# EAGLE design Flutter-v1 (EAGLE 9.6.1)
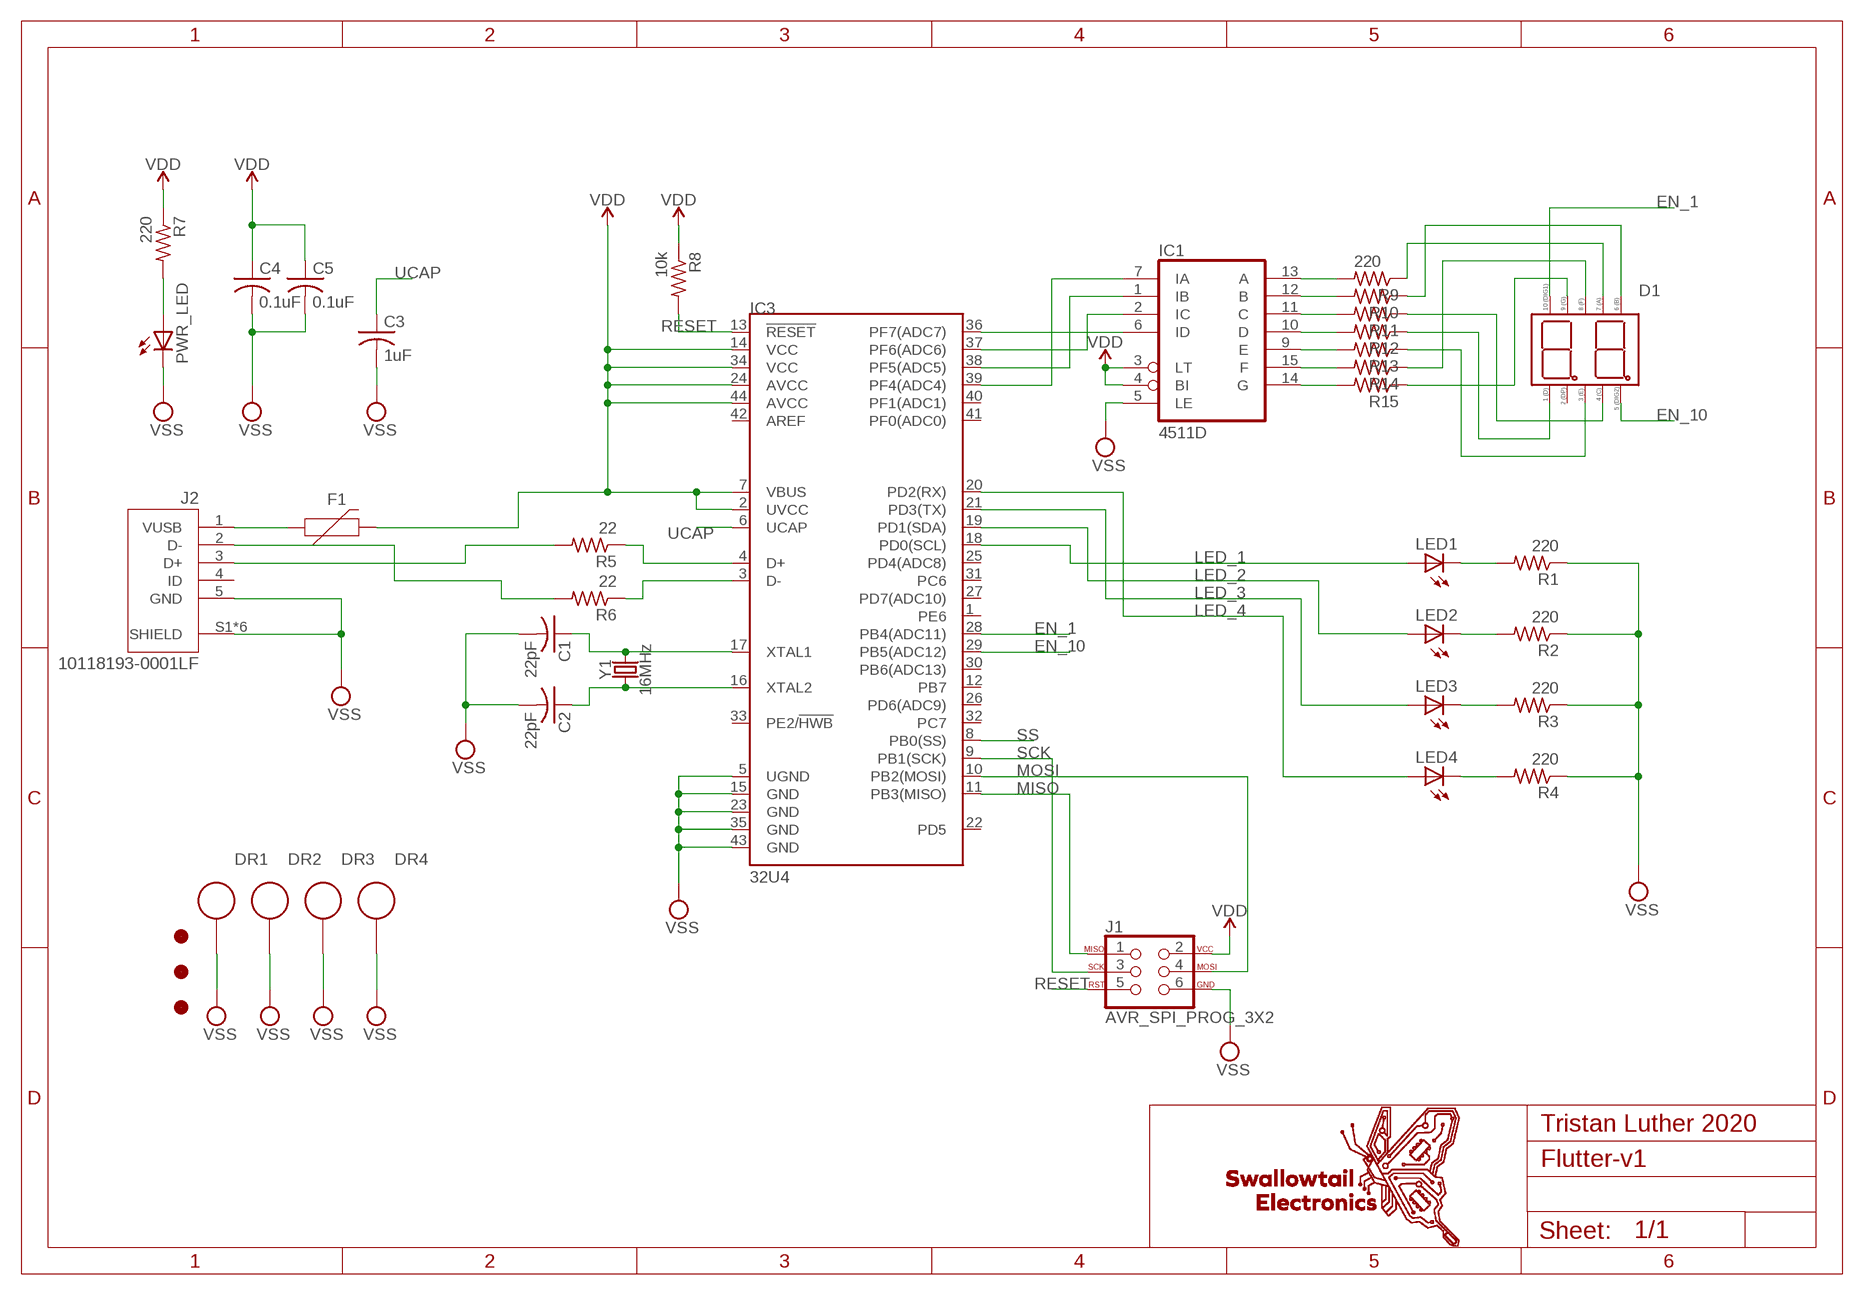
[diagram p0: schematic, sheet 1]

## Parts
C1  22pF  C-USC0805  [C0805]
C2  22pF  C-USC0805  [C0805]
C3  1uF  C-USC0805  [C0805]
C4  0.1uF  C-USC0805  [C0805]
C5  0.1uF  C-USC0805  [C0805]
D1  4201AS  [4201AS]
DR1  3MM_DRILL_GND  [3MM_DRILL_GND]
DR2  3MM_DRILL_GND  [3MM_DRILL_GND]
DR3  3MM_DRILL_GND  [3MM_DRILL_GND]
DR4  3MM_DRILL_GND  [3MM_DRILL_GND]
F1  6V/0.5A  PPTC_HALF-AMP  [1206]
IC1  4511D  [SO16]
IC3  32U4  ATMEGA32U4TQFP-44  [TQFP44]
J1  AVR_SPI_PROG_3X2  [2X3-NS]
J2  10118193-0001LF  [FCI_10118193-0001LF]
LED1  LED5MM  [LED5MM]
LED2  LED5MM  [LED5MM]
LED3  LED5MM  [LED5MM]
LED4  LED5MM  [LED5MM]
PWR_LED  LEDCHIPLED_0603  [CHIPLED_0603]
R1  220  R-US_M0805  [M0805]
R2  220  R-US_M0805  [M0805]
R3  220  R-US_M0805  [M0805]
R4  220  R-US_M0805  [M0805]
R5  22  R-US_M0805  [M0805]
R6  22  R-US_M0805  [M0805]
R7  220  R-US_M0805  [M0805]
R8  10k  R-US_M0805  [M0805]
R9  220  R-US_M0805  [M0805]
R10  220  R-US_M0805  [M0805]
R11  220  R-US_M0805  [M0805]
R12  220  R-US_M0805  [M0805]
R13  220  R-US_M0805  [M0805]
R14  220  R-US_M0805  [M0805]
R15  220  R-US_M0805  [M0805]
U$4  FIDUCIAL_MARKER  [FIDUCIAL_MARKER]
U$5  FIDUCIAL_MARKER  [FIDUCIAL_MARKER]
U$6  FIDUCIAL_MARKER  [FIDUCIAL_MARKER]
Y1  16MHz  CRYSTAL-16MHZSMD-5X3.2  [CRYSTAL-SMD-5X3.2-4PAD]

## Nets
EN_1: D1.10 IC3.28(PB4(ADC11))
EN_10: D1.5(5(DIG_2)) IC3.29(PB5(ADC12))
LED_1: IC3.18(PD0(SCL)) LED1.A
LED_2: IC3.19(PD1(SDA)) LED2.A
LED_3: IC3.21(PD3(TX)) LED3.A
LED_4: IC3.20(PD2(RX)) LED4.A
MISO: IC3.11(PB3(MISO)) J1.1
MOSI: IC3.10(PB2(MOSI)) J1.4
N$1: IC3.4(D+) R5.1
N$2: IC3.3(D-) R6.1
N$3: J2.3(D+) R5.2
N$4: J2.2(D-) R6.2
N$5 [VDD/VSS]: PWR_LED.A R7.2
N$6: C1.1 IC3.17(XTAL1) Y1.3
N$7: C2.1 IC3.16(XTAL2) Y1.1
N$8: IC1.13(A) R9.2
N$9: LED1.K(C) R1.2
N$10: LED2.K(C) R2.2
N$11: LED3.K(C) R3.2
N$12: LED4.K(C) R4.2
N$13: IC1.12(B) R10.2
N$14: IC1.11(C) R11.2
N$15: IC1.10(D) R12.2
N$16: IC1.9(E) R13.2
N$17: IC1.15(F) R14.2
N$18: IC1.14(G) R15.2
N$19 [VDD/VSS]: F1.1 J2.1(VUSB)
N$20: D1.7(7(A)) R9.1
N$21: D1.6(6(B)) R10.1
N$22: D1.4(4(C)) R11.1
N$23: IC1.7(IA) IC3.39(PF4(ADC4))
N$24: IC1.1(IB) IC3.38(PF5(ADC5))
N$25: IC1.2(IC) IC3.37(PF6(ADC6))
N$26: IC1.6(ID) IC3.36(PF7(ADC7))
N$27: D1.1(1(D)) R12.1
N$28: D1.3(3(E)) R13.1
N$29: D1.8(8(F)) R14.1
N$30: D1.9(9(G)) R15.1
RESET: IC3.13(!RESET) J1.5 R8.2
SCK: IC3.9(PB1(SCK)) J1.3
SS: IC3.8(PB0(SS))
UCAP: C3.1 IC3.6(UCAP)
VDD: C4.1 C5.1 F1.2 IC1.3(LT) IC1.4(BI) IC3.2(UVCC) IC3.7(VBUS) IC3.14(VCC) IC3.24(AVCC) IC3.34(VCC) IC3.44(AVCC) J1.2 R7.1 R8.1
VSS [VDD/VSS]: C1.2 C2.2 C3.2 C4.2 C5.2 DR1.DR(D$1) DR2.DR(D$1) DR3.DR(D$1) DR4.DR(D$1) IC1.5(LE) IC3.5(UGND) IC3.15(GND) IC3.23(GND) IC3.35(GND) IC3.43(GND) J1.6 J2.5(GND) J2.S1(SHIELD) J2.S2(SHIELD) J2.S3(SHIELD) J2.S4(SHIELD) J2.S5(SHIELD) J2.S6(SHIELD) PWR_LED.C R1.1 R2.1 R3.1 R4.1
Unconnected: D1.2(2(DP)) IC3.1(PE6) IC3.12(PB7) IC3.22(PD5) IC3.25(PD4(ADC8)) IC3.26(PD6(ADC9)) IC3.27(PD7(ADC10)) IC3.30(PB6(ADC13)) IC3.31(PC6) IC3.32(PC7) IC3.33(PE2/!HWB) IC3.40(PF1(ADC1)) IC3.41(PF0(ADC0)) IC3.42(AREF) J2.4(ID)

## Power pins joined to a net without a drawn wire
VDD: IC1.16(VDD)
VSS: IC1.8(VSS)

## Library data of the parts
C1-C5 = adafruit:C-US: CAPACITOR, American symbol
D1 = MyLibrary:4201AS: 4201AS Dual Common Cathode Seven Segment Display Common China Export: Sale Link <https://www.aliexpress.com/item/32910087970.html?spm=a2g0o.productlist.0.0.5d2916435btpmH&algo_pvid=f7d3615c-b2d9-4175-8957-436fe814a7c2&algo_expid=f7d3615c-b2d9-4175-8957-436fe814a7c2-1&btsid=0ab50a5715883508853971879e6b41&ws_ab_test=searchweb0_0,searchweb201602_,searchweb201603_>
DR1-DR4 = MyLibrary:3MM_DRILL_GND: Common 3mm Machine Screw Hole. Better than your standard drill! Connects to the ground of the circuit board to the enclosure.
F1 = SparkFun-Fuses:PPTC: Resettable Fuse PPTC Resettable Fuse. Really a sort of resistor with a polymeric positive temperature coefficient whose resistance increases dramatically with an increase in temperature. When heated by the power passing through the resistance rises causing the current to be limited, protecting the circuit. This is achieved by the transition of the polymer from a crystalline to an amorphous state where the conductive carbon separates breaking the conductive pathways found in the cool crystalline structure. When a PPTC cools back down it resumes conducting letting the circuit turn back on. SparkFun Products: SparkFun RedBoard - Programmed with Arduino <https://www.sparkfun.com/products/12757> Pro Micro - 5V/16MHz <https://www.sparkfun.com/products/12640> Arduino Pro 328 - 5V/16MHz <https://www.sparkfun.com/products/10915> MP3 Trigger <https://www.sparkfun.com/products/13720>; PROD_ID: RES-08585
IC1 = 45xx:4511: BCD to 7-segment LATCH/DECODER/DRIVER
IC3 = SparkFun-IC-Microcontroller:ATMEGA32U4: Atmel MCU, 32KByte Atmel 44-pin 8-bit Microcontroller with 32KBytes of ISP Flash and USB Controller Datasheet <http://cdn.sparkfun.com/datasheets/Dev/Arduino/Boards/ATMega32U4.pdf> SparkFun Products LilyPad Arduino USB - ATmega32U4 Board <https://www.sparkfun.com/products/12049> (DEV-12049) Pro Micro - 5V/16MHz <https://www.sparkfun.com/products/12640> (DEV-12640) Pro Micro - 3.3V/8MHz <https://www.sparkfun.com/products/12587> (DEV-12587) Fio v3 - ATmega32U4 <https://www.sparkfun.com/products/11520> (DEV-11520) Qduino Mini <https://www.sparkfun.com/products/13614> (DEV-13614) Makey Makey - Standard Kit <https://www.sparkfun.com/products/11511> (WIG-11511) Makey Makey Deluxe Kit <https://www.sparkfun.com/products/11519> (WIG-11519); PROD_ID: IC-11161
J1 = MyLibrary:AVR_SPI_PROG_3X2: AVR ISP 6 Pin This is the reduced ISP connector for AVR programming. Common on Arduino. This footprint will take up less PCB space and can be used with a 10-pin to 6-pin adapter such as SKU: BOB-08508 **Special note about "TEST_POINT" package. The stop mask is on the top side, so if you want your programming test points to be on the bottom of your board, make sure to place this package on the bottom side of the board. This also ensure that the orientation to program from the bottom side will be correct. SparkFun Products: SparkFun ISP Pogo Adapter <https://www.sparkfun.com/products/11591> - NS Tiny AVR Programmer <https://www.sparkfun.com/products/11801> -PTH
J2 = MyLibrary:10118193-0001LF: Micro USB B Type Receptacle; AVAILABILITY: Unavailable; DESCRIPTION: USB - micro B USB 2.0 Receptacle Connector 5 Position Surface Mount, Right Angle; Through Hole; MF: Amphenol ICC; MP: 10118193-0001LF; PACKAGE: None; PRICE: None
LED1-LED4 = MyLibrary:LED: LED OSRAM: - CHIPLED LG R971, LG N971, LY N971, LG Q971, LY Q971, LO R971, LY R971 LH N974, LH R974 LS Q976, LO Q976, LY Q976 LO Q996 - Hyper CHIPLED LW Q18S LB Q993, LB Q99A, LB R99A - SideLED LS A670, LO A670, LY A670, LG A670, LP A670 LB A673, LV A673, LT A673, LW A673 LH A674 LY A675 LS A676, LA A676, LO A676, LY A676, LW A676 LS A679, LY A679, LG A679 - Hyper Micro SIDELED® LS Y876, LA Y876, LO Y876, LY Y876 LT Y87S - SmartLED LW L88C, LW L88S LB L89C, LB L89S, LG L890 LS L89K, LO L89K, LY L89K LS L896, LA L896, LO L896, LY L896 - TOPLED LS T670, LO T670, LY T670, LG T670, LP T670 LSG T670, LSP T670, LSY T670, LOP T670, LYG T670 LG T671, LOG T671, LSG T671 LB T673, LV T673, LT T673, LW T673 LH T674 LS T676, LA T676, LO T676, LY T676, LB T676, LH T676, LSB T676, LW T676 LB T67C, LV T67C, LT T67C, LS T67K, LO T67K, LY T67K, LW E67C LS E67B, LA E67B, LO E67B, LY E67B, LB E67C, LV E67C, LT E67C LW T67C LS T679, LY T679, LG T679 LS T770, LO T770, LY T770, LG T770, LP T770 LB T773, LV T773, LT T773, LW T773 LH T774 LS E675, LA E675, LY E675, LS T675 LS T776, LA T776, LO T776, LY T776, LB T776 LHGB T686 LT T68C, LB T68C - Hyper Mini TOPLED® LB M676 - Mini TOPLED Santana® LG M470 LS M47K, LO M47K, LY M47K Source: http://www.osram.convergy.de/
PWR_LED = adafruit:LED: LED OSRAM: - CHIPLED LG R971, LG N971, LY N971, LG Q971, LY Q971, LO R971, LY R971 LH N974, LH R974 LS Q976, LO Q976, LY Q976 LO Q996 - Hyper CHIPLED LW Q18S LB Q993, LB Q99A, LB R99A - SideLED LS A670, LO A670, LY A670, LG A670, LP A670 LB A673, LV A673, LT A673, LW A673 LH A674 LY A675 LS A676, LA A676, LO A676, LY A676, LW A676 LS A679, LY A679, LG A679 - Hyper Micro SIDELED® LS Y876, LA Y876, LO Y876, LY Y876 LT Y87S - SmartLED LW L88C, LW L88S LB L89C, LB L89S, LG L890 LS L89K, LO L89K, LY L89K LS L896, LA L896, LO L896, LY L896 - TOPLED LS T670, LO T670, LY T670, LG T670, LP T670 LSG T670, LSP T670, LSY T670, LOP T670, LYG T670 LG T671, LOG T671, LSG T671 LB T673, LV T673, LT T673, LW T673 LH T674 LS T676, LA T676, LO T676, LY T676, LB T676, LH T676, LSB T676, LW T676 LB T67C, LV T67C, LT T67C, LS T67K, LO T67K, LY T67K, LW E67C LS E67B, LA E67B, LO E67B, LY E67B, LB E67C, LV E67C, LT E67C LW T67C LS T679, LY T679, LG T679 LS T770, LO T770, LY T770, LG T770, LP T770 LB T773, LV T773, LT T773, LW T773 LH T774 LS E675, LA E675, LY E675, LS T675 LS T776, LA T776, LO T776, LY T776, LB T776 LHGB T686 LT T68C, LB T68C - Hyper Mini TOPLED® LB M676 - Mini TOPLED Santana® LG M470 LS M47K, LO M47K, LY M47K Source: http://www.osram.convergy.de/
R1-R15 = adafruit:R-US_: RESISTOR, American symbol
U$4-U$6 = MyLibrary:FIDUCIAL_MARKER: Fiducial Marker for easy manufacturing/board population by means of a pick and place machine. Suggest placing 3 on a board on 3 out of 4 corners (allows populator to determine orientation).
Y1 = SparkFun-Clocks:CRYSTAL-16MHZ: 16MHz Crystal Digikey Example <http://www.digikey.com/product-search/en?keywords=535-9122-1-ND> Frequency: 16MHz Frequency Stability: ±50ppm Frequency Tolerance: ±20ppm Load Capacitance: 18pF SparkFun Products: Pro Micro -5V/16MHz <https://www.sparkfun.com/products/12640> SparkFun Serial Enabled LCD Kit <https://www.sparkfun.com/products/10097>; PROD_ID: XTAL-08218; SF_ID: COM-00094

## Net classes
0 default: width 0.254 mm
1 VDD/VSS: width 0.508 mm

## Board
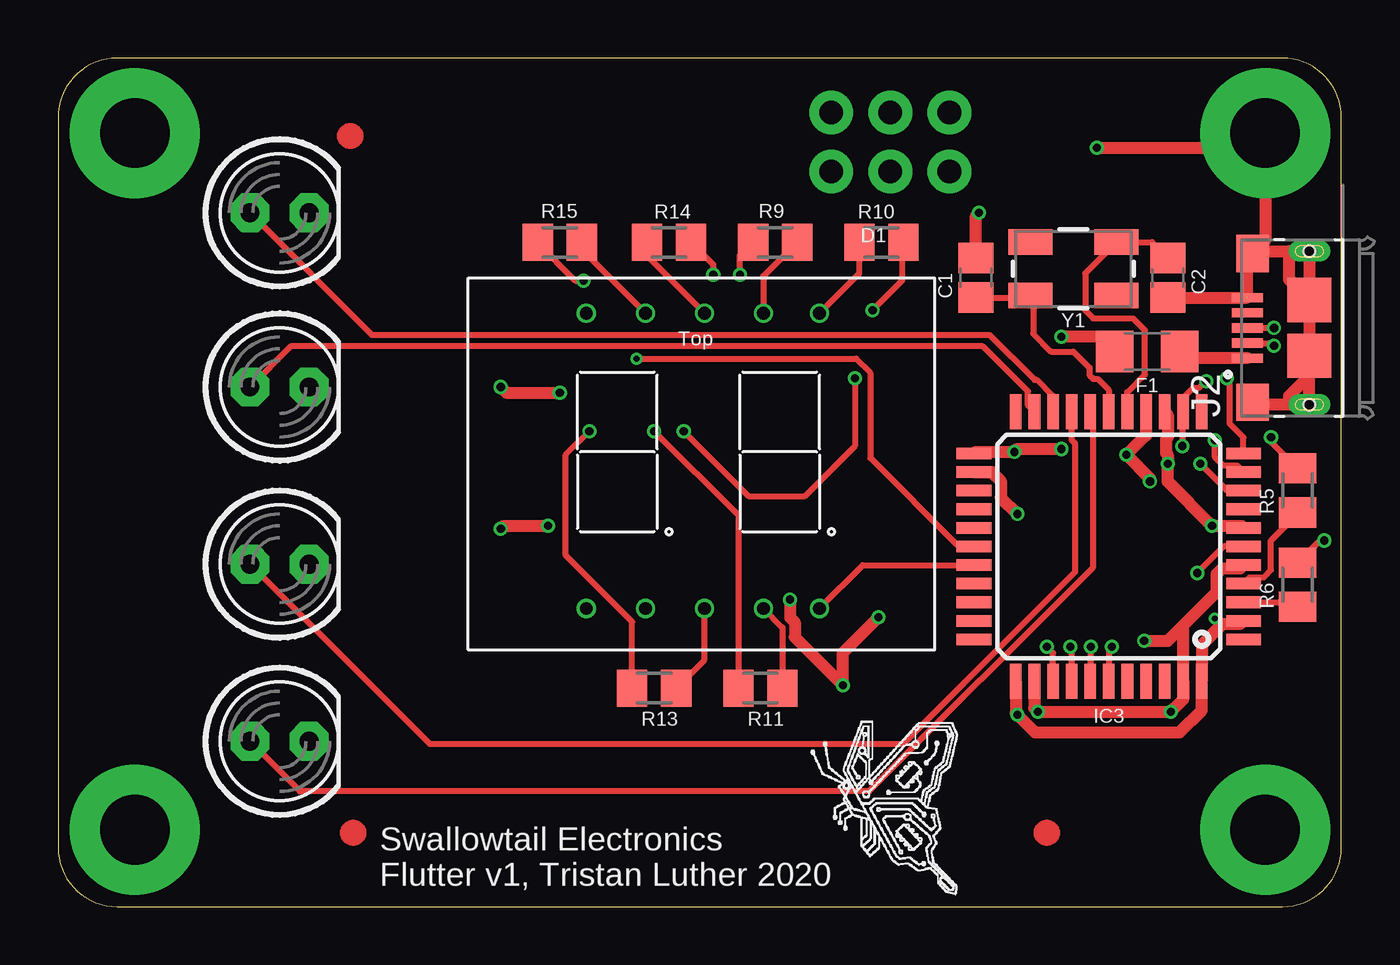
[diagram p1: board, top side]
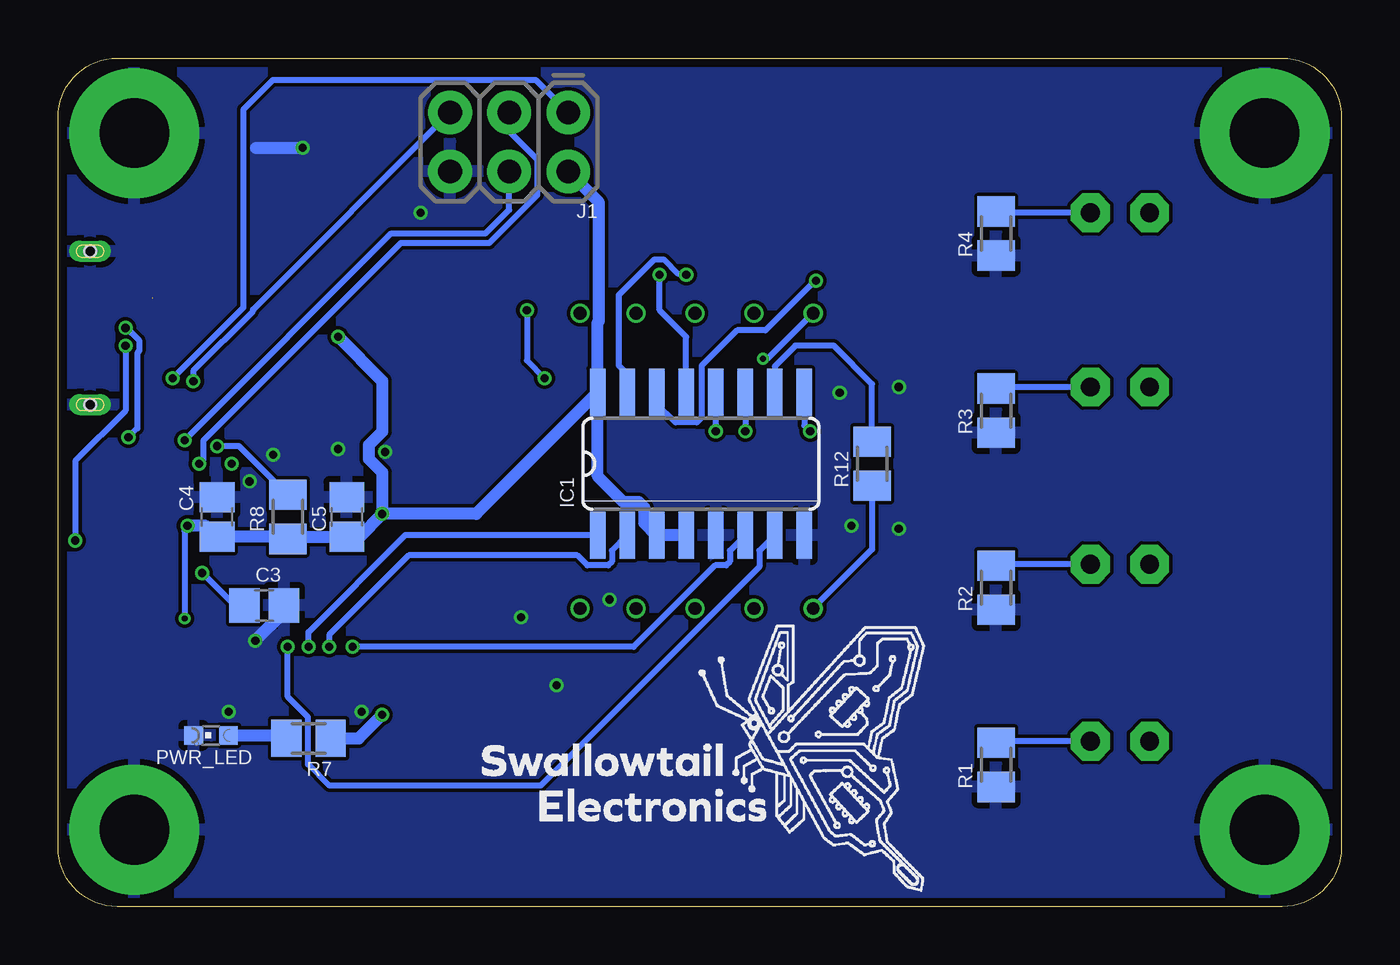
[diagram p2: board, bottom side, seen from below]

Size 55.23 x 36.5 mm. Coordinates in mm from the lower left corner, seen from the top.
Outline: 0,33.96 0,2.54 arc90 2.54,0 52.69,0 arc90 55.23,2.54 55.23,33.96 arc90 52.69,36.5 2.54,36.5 arc90 0,33.96
Copper layers (1*16): Top 0.035559375mm / dielectric 1.6mm / Bottom 0.035559375mm
Design rules "oshpark-2layer": minimum track width 6mil, minimum drill 10mil, track to track 6mil, track to pad 6mil, pad to pad 6mil, via to via 6mil, smd to smd 6mil, copper to edge 15mil, drill to drill 6mil, minimum pad ring 5mil, minimum via ring 5mil, stop-mask expansion 2.5mil, vias tented up to drill 0mil, thermal gap 10mil

### Footprints (pad centres in the part's own frame; a part is rotated, then mirrored left to right if it is on the bottom)
C0805 = smd 1.3 x 1.5: 1 -0.85,0; 2 0.85,0
4201AS = drill 0.55: 1 5.08,1.778; 2 7.62,1.778; 3 10.16,1.778; 4 12.7,1.778; 5 15.113,1.778; 6 15.113,14.478; 7 12.7,14.478; 8 10.16,14.478; 9 7.62,14.478; 10 5.08,14.478
3MM_DRILL_GND = drill 3 pad 5.6: DR 0,0.127
1206 = smd 1.6 x 1.8: 1 -1.4,0; 2 1.4,0
SO16 = smd 0.66 x 2.032: 1 -4.445,-3.073; 2 -3.175,-3.073; 3 -1.905,-3.073; 4 -0.635,-3.073; 5 0.635,-3.073; 6 1.905,-3.073; 7 3.175,-3.073; 8 4.445,-3.073; 9 4.445,3.073; 10 3.175,3.073; 11 1.905,3.073; 12 0.635,3.073; 13 -0.635,3.073; 14 -1.905,3.073; 15 -3.175,3.073; 16 -4.445,3.073
TQFP44 = smd 1.5 x 0.5: 1 -5.8,4; 2 -5.8,3.2; 3 -5.8,2.4; 4 -5.8,1.6; 5 -5.8,0.8; 6 -5.8,0; 7 -5.8,-0.8; 8 -5.8,-1.6; 9 -5.8,-2.4; 10 -5.8,-3.2; 11 -5.8,-4; 23 5.8,-4; 24 5.8,-3.2; 25 5.8,-2.4; 26 5.8,-1.6; 27 5.8,-0.8; 28 5.8,0; 29 5.8,0.8; 30 5.8,1.6; 31 5.8,2.4; 32 5.8,3.2; 33 5.8,4 | smd 0.5 x 1.5: 12 -4,-5.8; 13 -3.2,-5.8; 14 -2.4,-5.8; 15 -1.6,-5.8; 16 -0.8,-5.8; 17 0,-5.8; 18 0.8,-5.8; 19 1.6,-5.8; 20 2.4,-5.8; 21 3.2,-5.8; 22 4,-5.8; 34 4,5.8; 35 3.2,5.8; 36 2.4,5.8; 37 1.6,5.8; 38 0.8,5.8; 39 0,5.8; 40 -0.8,5.8; 41 -1.6,5.8; 42 -2.4,5.8; 43 -3.2,5.8; 44 -4,5.8
2X3-NS = drill 1.016 pad 1.88: 1 -2.54,-1.27; 2 -2.54,1.27; 3 0,-1.27; 4 0,1.27; 5 2.54,-1.27; 6 2.54,1.27
FCI_10118193-0001LF = smd 0.4 x 1.35: 1 -1.3,2.675; 2 -0.65,2.675; 3 0,2.675; 4 0.65,2.675; 5 1.3,2.675 | smd 1.6 x 1.4: S1 -3.2,2.45; S2 3.2,2.45 | smd 1.9 x 1.9: S3 1.2,0; S4 -1.2,0 | drill 0.5 pad 0.9 long: S5 -3.3,0; S6 3.3,0 | hole 0.5: -3.3,0; 3.3,0
LED5MM = drill 0.813 pad 1.676 octagon: A -1.27,0; K 1.27,0
CHIPLED_0603 = smd 0.8 x 0.8: A 0,-0.75; C 0,0.75
M0805 = smd 1.3 x 1.6: 1 -0.95,0; 2 0.95,0
CRYSTAL-SMD-5X3.2-4PAD = smd 1.9 x 1.1: 1 -1.85,-1.15; 2 1.85,-1.15; 3 1.85,1.15; 4 -1.85,1.15

### Placement (x,y rotation side)
C1  39.5,27.05 90 top
C2  47.75,27.05 270 top
C3  46.35,12.95 0 bottom
C4  48.39,16.76 90 bottom
C5  42.8,16.76 90 bottom
D1  17.65,11.05 0 top
DR1  51.94,3.17 0 top
DR2  51.94,33.15 0 top
DR3  3.3,33.15 0 top
DR4  3.3,3.17 0 top
F1  46.86,23.88 180 top
IC1  27.56,19.05 0 bottom
IC3  45.21,15.49 180 top
J1  35.81,32.89 180 bottom
J2  53.85,24.89 90 top
LED1  9.53,7.11 0 top
LED2  9.53,14.73 0 top
LED3  9.53,22.35 0 top
LED4  9.53,29.84 0 top
PWR_LED  48.64,7.37 90 bottom
R1  14.86,6.1 90 bottom
R2  14.86,13.72 90 bottom
R3  14.86,21.34 90 bottom
R4  14.86,28.96 90 bottom
R5  53.34,17.91 90 top
R6  53.34,13.84 90 top
R7  44.45,7.24 180 bottom
R8  45.34,16.76 90 bottom
R9  30.86,28.57 180 top
R10  35.43,28.57 0 top
R11  30.23,9.4 180 top
R12  20.19,19.05 90 bottom
R13  25.65,9.4 180 top
R14  26.29,28.57 0 top
R15  21.59,28.57 180 top
U$2  [SWALLOWTAIL_LOGO]  36.96,0.64 0 bottom
U$3  [SMALL_SWALLOWTAIL_NO_TEXT]  32.38,0.51 0 top
U$4  12.7,3.17 0 top
U$5  12.57,33.15 0 top
U$6  42.55,3.17 0 top
Y1  43.69,27.43 180 top

### Tracks (layer width: path | path; a pad name or v marks a point on that pad's centre or on a via)
EN_1  (via drill 0.25)
  Top 0.254: v24.89,23.57 34.34,23.57 34.95,22.96 34.95,19.3 38.71,15.54 39.32,15.54 IC3.28
  Bottom 0.254: v24.89,23.57 24.69,23.57 D1.10
EN_10
  Top 0.254: D1.5 34.63,14.69 IC3.29
LED_1
  Top 0.254: IC3.18 44.52,21.18 44.52,14.57 34.9,4.95 10.41,4.95 LED1.A
LED_2
  Top 0.254: IC3.19 43.61,20.07 43.76,19.93 43.76,14.39 36.36,6.99 16,6.99 LED2.A
LED_3
  Top 0.254: IC3.21 41.74,21.57 41.74,22.16 39.8,24.11 10.01,24.11 LED3.A
LED_4
  Top 0.254: IC3.20 42.81,21.96 42.12,22.65 42.03,22.65 40.1,24.59 13.51,24.59 LED4.A
MISO  (via drill 0.35)
  Top 0.254: v50.29,22.73 50.42,22.61 50.42,20.78 51.01,20.18 IC3.11
  Bottom 0.254: v50.29,22.73 47.24,25.78 47.24,34.29 45.97,35.56 34.67,35.56 J1.1
MOSI  (via drill 0.35)
  Top 0.254: IC3.10 50.74,18.96 50.15,18.96 49.78,19.33 v49.78,20.07
  Bottom 0.254: v49.78,20.07 40.89,28.96 36.83,28.96 35.81,29.97 J1.4
N$1
  Top 0.254: IC3.4 51.28,14.16 51.88,14.16 52.2,14.48 52.2,15.75 53.34,16.89 R5.1
N$2
  Top 0.254: IC3.3 53.14,13.09 R6.1
N$3  (via drill 0.35)
  Top 0.254: v52.2,20.19 52.2,20 R5.2 | J2.3 v52.32,24.89
  Bottom 0.254: v52.32,24.89 52.14,24.71 52.08,24.71 51.74,24.37 51.74,23.89 51.82,23.82 51.82,20.57 v52.2,20.19
N$4  (via drill 0.35)
  Top 0.254: v52.32,24.13 52.21,24.24 J2.2 | v54.48,15.75 54.3,15.75 R6.2
  Bottom 0.254: v52.32,24.13 52.32,21.34 54.48,19.18 v54.48,15.75
N$5
  Bottom 0.508: PWR_LED.A 45.53,7.37 R7.2
N$6
  Top 0.254: C1.1 41.76,26.2 Y1.3 41.97,26.16 41.97,24.64 42.73,23.88 43.69,23.88 44.38,23.18 44.38,22.86 44.55,22.7 44.74,22.7 45.21,22.23 IC3.17
N$7
  Top 0.254: C2.1 47.07,28.58 Y1.1 44.2,27.24 44.2,25.65 44.54,25.31 46.25,25.31 46.77,24.79 46.77,22.9 46.01,22.14 IC3.16
N$8  (via drill 0.35)
  Top 0.254: v29.34,27.18 29.34,28 R9.2
  Bottom 0.254: IC1.13 28.19,24.51 29.34,25.65 v29.34,27.18
N$9
  Bottom 0.254: LED1.K 14.79,7.11 R1.2
N$10
  Bottom 0.254: LED2.K 14.79,14.73 R2.2
N$11
  Bottom 0.254: LED3.K 14.79,22.35 R3.2
N$12
  Bottom 0.254: LED4.K 14.8,29.84 R4.2
N$13  (via drill 0.35)
  Top 0.254: R10.2 36.32,28.51 36.32,26.92 v35.05,25.65 | v34.29,22.73 34.29,19.81 32.13,17.65 29.72,17.65 v26.92,20.45
  Bottom 0.254: v35.05,25.65 35.05,23.5 v34.29,22.73 | v26.92,20.45 IC1.12
N$14  (via drill 0.35)
  Top 0.254: v25.65,20.45 29.28,16.82 R11.2
  Bottom 0.254: IC1.11 v25.65,20.45
N$15
  Bottom 0.254: R12.2 20.19,22.48 21.84,24.13 23.5,24.13 24.38,23.24 IC1.10
N$16  (via drill 0.35)
  Top 0.254: R13.2 24.7,12.25 21.84,15.11 21.84,19.43 v22.86,20.45
  Bottom 0.254: IC1.9 23.11,20.7 v22.86,20.45
N$17  (via drill 0.35)
  Top 0.254: v28.19,27.18 28.19,27.62 R14.2
  Bottom 0.254: v28.19,27.18 28.25,27.23 28.55,27.23 29.16,27.84 29.57,27.84 31.09,26.31 31.09,23.27 30.79,22.96 IC1.15
N$18  (via drill 0.35)
  Top 0.254: v22.61,26.92 22.25,26.92 20.62,28.55 R15.2
  Bottom 0.254: IC1.14 29.46,21.64 28.65,20.83 27.74,20.83 27.53,21.03 27.53,23.27 26.01,24.79 24.79,24.79 22.66,26.92 v22.61,26.92
N$19
  Top 0.508: J2.1 48.55,23.59 F1.1
N$20
  Top 0.254: R9.1 30.35,27.12 D1.7
N$21
  Top 0.254: D1.6 34.48,27.24 R10.1
N$22
  Top 0.254: D1.4 31.18,12 R11.1
N$23  (via drill 0.35)
  Top 0.254: v45.34,11.18 45.21,11.05 IC3.39
  Bottom 0.254: IC1.7 25.04,15.32 25.04,14.62 34.45,5.21 43.56,5.21 44.47,6.12 44.47,8.15 45.34,9.02 v45.34,11.18
N$24  (via drill 0.35)
  Top 0.254: IC3.38 44.45,9.73 v44.45,11.18
  Bottom 0.254: IC1.1 40.28,15.98 44.45,11.81 v44.45,11.18
N$25  (via drill 0.35)
  Top 0.254: v43.56,11.18 43.61,11.12 IC3.37
  Bottom 0.254: IC1.2 31.39,15.32 31.39,14.85 31.56,14.68 32.45,14.68 32.88,15.11 40.13,15.11 43.56,11.68 v43.56,11.18
N$26  (via drill 0.35)
  Top 0.254: IC3.36 42.81,10.91 v42.55,11.18
  Bottom 0.254: v42.55,11.18 30.45,11.18 26.95,14.68 26.48,14.68 26.31,14.85 26.31,15.32 IC1.6
N$27
  Bottom 0.254: R12.1 20.19,15.37 D1.1
N$28
  Top 0.254: R13.1 27.81,10.61 D1.3
N$29
  Top 0.254: R14.1 25.34,28 D1.8
N$30
  Top 0.254: D1.9 22.54,28.26 R15.1
RESET  (via drill 0.35)
  Top 0.254: v48.39,19.81 48.39,21.27 IC3.13 48.41,21.89 48.85,22.32 49.12,22.32 v49.4,22.61
  Bottom 0.254: R8.2 47.44,19.81 v48.39,19.81 | J1.5 46.84,25.68 46.84,25.61 49.4,23.05 v49.4,22.61
SCK  (via drill 0.35)
  Top 0.254: v49.15,19.05 50.3,17.89 IC3.9
  Bottom 0.254: v49.15,19.05 48.97,19.23 48.97,20.05 40.47,28.55 36.66,28.55 34.59,30.62 34.59,32.13 35.81,33.35 J1.3
UCAP  (via drill 0.35)
  Top 0.254: IC3.6 50.16,15.49 v49.02,14.35
  Bottom 0.254: C3.1 47.62,12.95 v49.02,14.35
VDD  (via drill 0.25, 0.35)
  Top 0.254: v49.78,12.39 50.06,12.12
  Top 0.508: v41.27,16.89 40.57,17.6 40.57,18.31 40.19,18.69 IC3.24 | F1.2 44.83,24.51 v43.18,24.51 | IC3.34 41.21,8.32 v41.27,8.26 42.04,7.49 48.26,7.49 49.21,8.45 IC3.44 49.21,11.27 50.06,12.12 50.09,12.15 50.87,12.15 IC3.2 | IC3.7 50.92,16.38 v49.66,16.38 47.75,18.29 v47.75,19.05 47.75,19.45 47.68,19.52 47.68,20.11 47.75,20.18 47.75,21.15 IC3.14
  Bottom 0.254: v49.78,12.39 49.78,16.15 v49.66,16.38
  Bottom 0.508: v41.27,16.89 42.25,15.91 C5.1 45.24,15.91 R8.1 45.44,15.91 C4.1 48.86,16.38 v49.66,16.38 | R7.1 42.29,7.24 v41.27,8.26 | v43.18,24.51 41.27,22.61 41.27,20.43 41.86,19.85 41.86,19.27 41.27,18.68 v41.27,16.89 | IC1.16 37.24,16.89 v41.27,16.89 | IC1.4 IC1.3 30,16.51 30,17.16 30.23,17.4 30.89,17.4 32,18.52 IC1.16 | IC1.16 32,25.13 31.95,25.19 31.95,30.3 J1.2
VSS  (via drill 0.35)  (1 unrouted)
  Top 0.508: IC3.23 39.48,19.56 v41.15,19.56 41.27,19.68 v43.18,19.68 | C1.2 39.5,29.72 v39.62,29.84 | C2.2 51.16,26.2 | 48.41,12.09 IC3.43 48.41,8.91 v47.88,8.38 v42.16,8.38 42.01,8.53 IC3.35 | 48.41,12.09 49.86,13.54 49.86,14.31 50.09,14.55 50.87,14.55 IC3.5 | v46.99,18.29 46.99,18.41 v45.97,19.43 46.81,20.27 IC3.15 | v44.7,32.64 51.31,32.64 DR2.DR 51.94,28.64 J2.S2 | v19.05,16.26 19.18,16.38 v21.08,16.38 | v31.5,13.21 31.5,12.44 31.71,12.22 31.71,11.6 v33.78,9.53 33.78,10.92 v35.31,12.45 | v46.74,11.43 47.75,11.43 48.41,12.09 | v19.05,22.35 19.3,22.1 v21.59,22.1 | J2.5 51.17,27.87 J2.S2 | J2.S2 51.5,28.19 52.96,28.19 52.96,26.98 J2.S3 | J2.S3 J2.S4 | J2.S4 53.85,22.84 52.96,21.96 52.96,21.59 51.5,21.59 J2.S1 | J2.S6 J2.S3 | J2.S5 J2.S4
  Bottom 0.508: 46.71,32.64 v44.7,32.64 | C3.2 45.51,12.66 v46.74,11.43
  pour Bottom: 0.13,0 0.13,36.32 0.25,36.45 55.24,36.45 55.24,0

### Text on the board
tPlace: Swallowtail Electronics | Flutter v1, Tristan Luther 2020